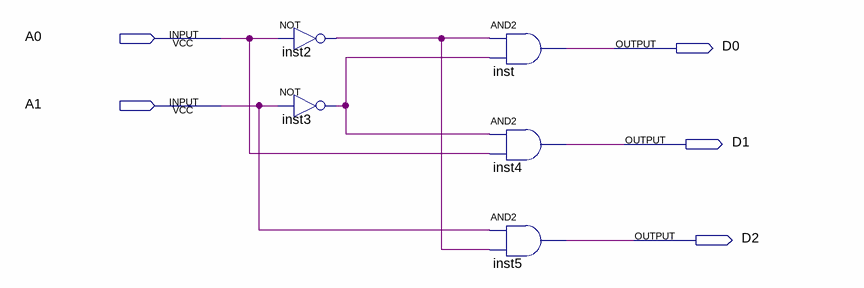
[diagram p0: schematic sheet]
// Quartus schematic 23DECODER.bdf as structural Verilog: 5 symbols, 5 pins
module \23DECODER  (
  input  A0,
  input  A1,
  output D0,
  output D1,
  output D2
);

  wire inst2_out, inst3_out;

  not inst2 (inst2_out, A0);
  not inst3 (inst3_out, A1);
  and inst (D0, inst2_out, inst3_out);
  and inst4 (D1, inst3_out, A0);
  and inst5 (D2, A1, inst2_out);
endmodule
